# EAGLE design esp32-s2_ePaper_pcb_v1 (EAGLE 9.6.2)
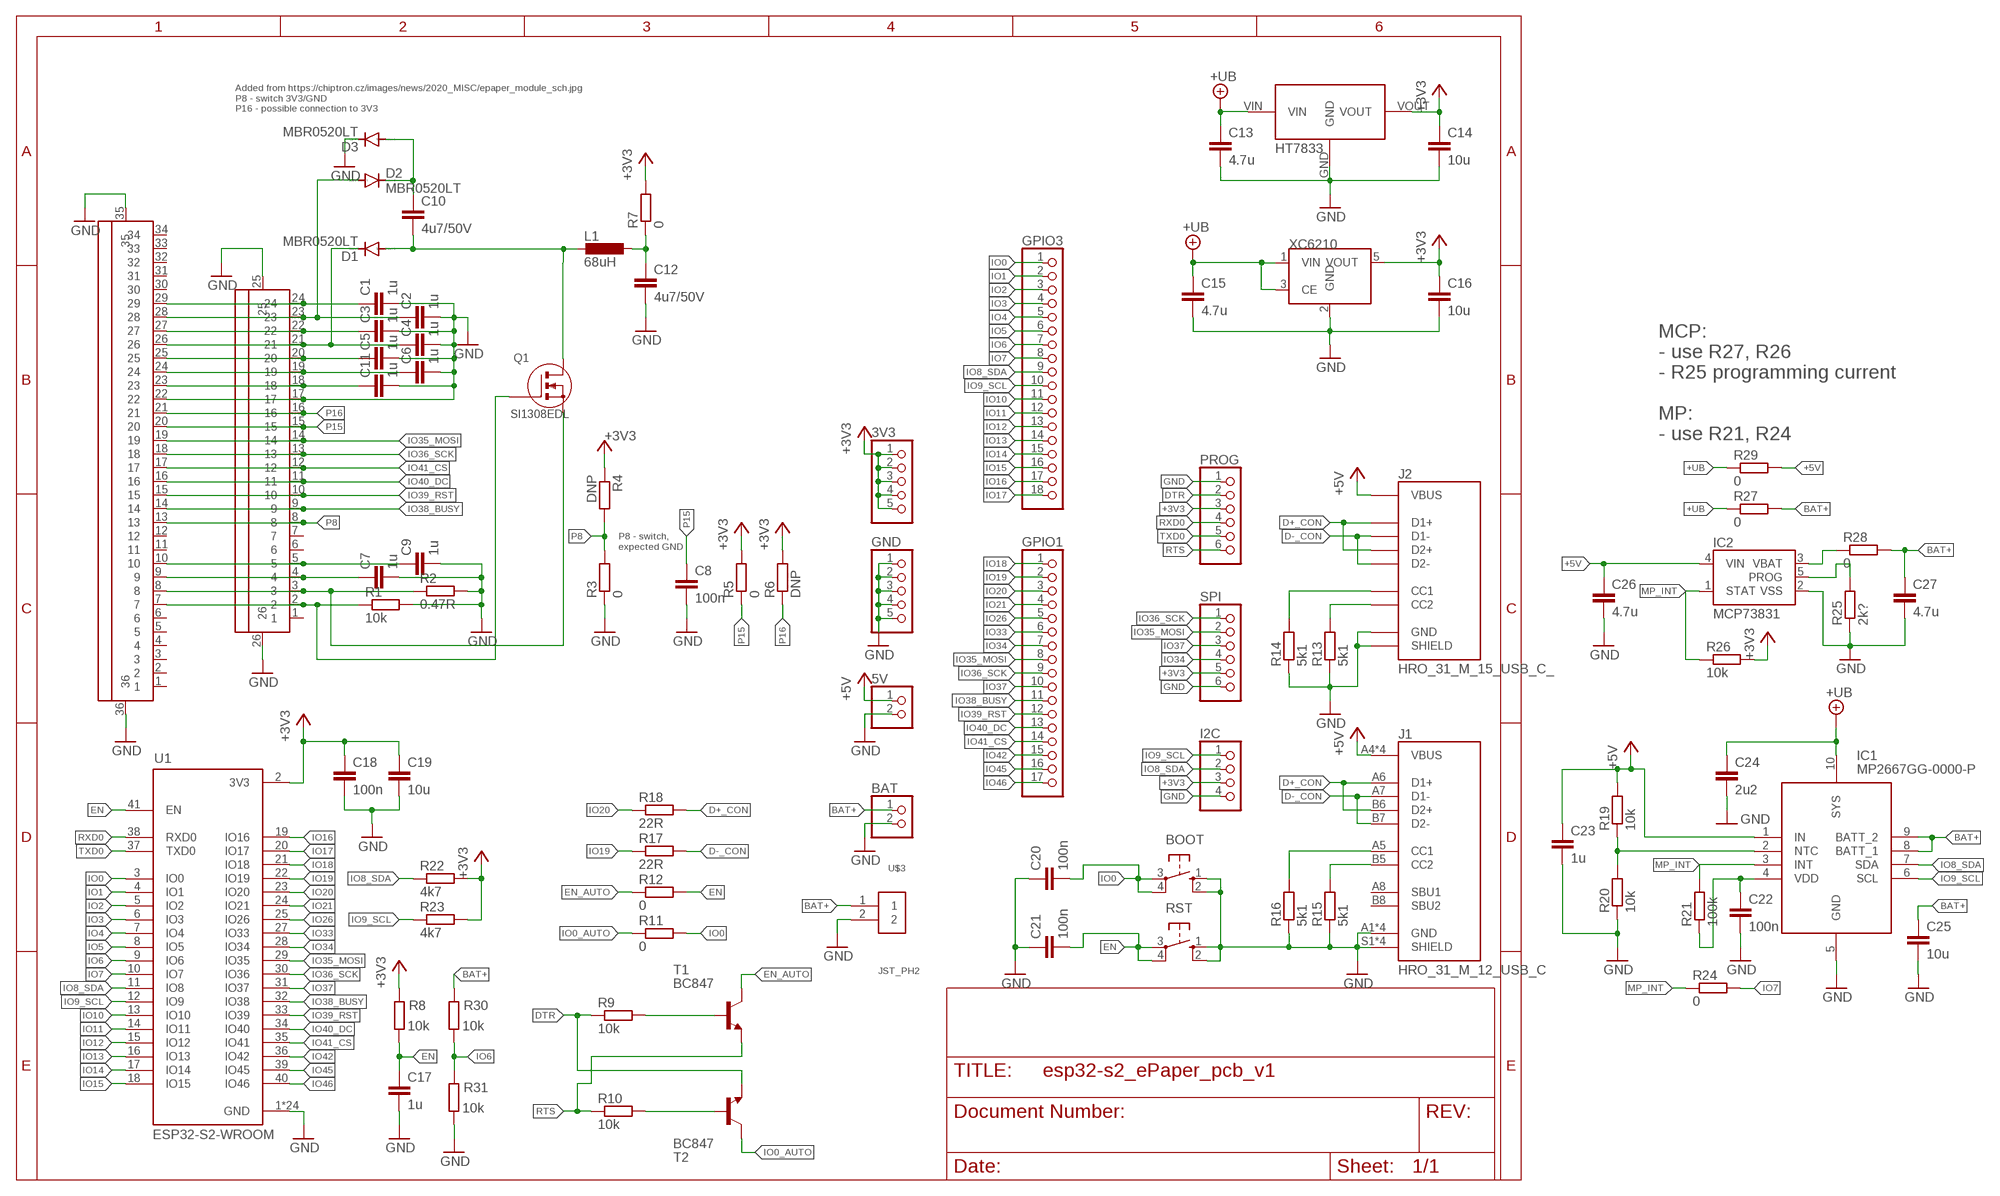
[diagram p0: schematic, sheet 1]

## Parts
3V3  PINHD-1X5  [1X05]
5V  PINHD-1X2  [1X02]
BAT  PINHD-1X2  [1X02]
BOOT  10-XX  [B3F-10XX]
C1  1u  C-EUC0603K  [C0603K]
C2  1u  C-EUC0603K  [C0603K]
C3  1u  C-EUC0603K  [C0603K]
C4  1u  C-EUC0603K  [C0603K]
C5  1u  C-EUC0603K  [C0603K]
C6  1u  C-EUC0603K  [C0603K]
C7  1u  C-EUC0603K  [C0603K]
C8  100n  C-EUC0603K  [C0603K]
C9  1u  C-EUC0603K  [C0603K]
C10  4u7/50V  C-EUC1206  [C1206]
C11  1u  C-EUC0603K  [C0603K]
C12  4u7/50V  C-EUC1206  [C1206]
C13  4.7u  C-EUC1206  [C1206]
C14  10u  C-EUC1206  [C1206]
C15  4.7u  C-EUC1206  [C1206]
C16  10u  C-EUC1206  [C1206]
C17  1u  C-EUC0603K  [C0603K]
C18  100n  C-EUC0603K  [C0603K]
C19  10u  C-EUC1206  [C1206]
C20  100n  C-EUC0603K  [C0603K]
C21  100n  C-EUC0603K  [C0603K]
C22  100n  C-EUC0603K  [C0603K]
C23  1u  C-EUC0603K  [C0603K]
C24  2u2  C-EUC1206  [C1206]
C25  10u  C-EUC1206  [C1206]
C26  4.7u  C-EUC1206  [C1206]
C27  4.7u  C-EUC1206  [C1206]
D1  MBR0520LT  [SOD123]
D2  MBR0520LT  [SOD123]
D3  MBR0520LT  [SOD123]
GND  PINHD-1X5  [1X05]
GPIO1  PINHD-1X17  [1X17]
GPIO3  PINHD-1X18  [1X18]
I2C  PINHD-1X4  [1X04]
IC1  MP2667GG-0000-P  [QFN50P200X200X105-10N]
IC2  MCP73831  [SOT95P290X120-5]
J1  HRO_31_M_12_USB_C  [HRO_31_M_12_USB_C]
J2  HRO_31_M_15_USB_C_  [HRO_31_M_15_USB_C]
L1  68uH  L-EUL4532P  [L4532P]
PROG  PINHD-1X6  [1X06]
Q1  SI1308EDL  [SC-70]
R1  10k  R-EU_R0603  [R0603]
R2  0.47R  R-EU_R0603  [R0603]
R3  0  R-EU_R0603  [R0603]
R4  DNP  R-EU_R0603  [R0603]
R5  0  R-EU_R0603  [R0603]
R6  DNP  R-EU_R0603  [R0603]
R7  0  R-EU_R0603  [R0603]
R8  10k  R-EU_R0603  [R0603]
R9  10k  R-EU_R0603  [R0603]
R10  10k  R-EU_R0603  [R0603]
R11  0  R-EU_R0603  [R0603]
R12  0  R-EU_R0603  [R0603]
R13  5k1  R-EU_R0603  [R0603]
R14  5k1  R-EU_R0603  [R0603]
R15  5k1  R-EU_R0603  [R0603]
R16  5k1  R-EU_R0603  [R0603]
R17  22R  R-EU_R0603  [R0603]
R18  22R  R-EU_R0603  [R0603]
R19  10k  R-EU_R0603  [R0603]
R20  10k  R-EU_R0603  [R0603]
R21  100k  R-EU_R0603  [R0603]
R22  4k7  R-EU_R0603  [R0603]
R23  4k7  R-EU_R0603  [R0603]
R24  0  R-EU_R0603  [R0603]
R25  2k?  R-EU_R0603  [R0603]
R26  10k  R-EU_R0603  [R0603]
R27  0  R-EU_R0603  [R0603]
R28  0  R-EU_R0603  [R0603]
R29  0  R-EU_R0603  [R0603]
R30  10k  R-EU_R0603  [R0603]
R31  10k  R-EU_R0603  [R0603]
RST  10-XX  [B3F-10XX]
SPI  PINHD-1X6  [1X06]
T1  BC847  [SOT23]
T2  BC847  [SOT23]
U1  ESP32-S2-WROOM  [XCVR_ESP32-S2-WROOM]
U2  HT7833  [SOT89]
U3  XC6210  [SOT-23-5]
U$1  AYF532435_FPC_24PIN_0.5  [FPC_0.5_24PIN]
U$2  AYF533435_FPC_34PIN_0.5  [FPC_0.5_34PIN]
U$3  JST_PH2  [JSTPH2]

## Nets
+3V3: 3V3.1 3V3.2 3V3.3 3V3.4 3V3.5 C14.1 C16.1 C18.1 C19.1 I2C.3 PROG.3 R4.1 R5.2 R6.2 R7.2 R8.2 R22.2 R23.2 R26.2 SPI.5 U1.2(3V3) U2.VOUT U3.5(VOUT)
+5V: 5V.1 C23.1 C26.1 IC1.1(IN) IC2.4(VIN) J1.A4(VBUS) J1.A9(VBUS) J1.B4(VBUS) J1.B9(VBUS) J2.P$2(VBUS) J2.P$6(VBUS) J2.P$9(VBUS) J2.P$13(VBUS) R19.2 R29.2
+UB: C13.1 C15.1 C24.1 IC1.10(SYS) R27.1 R29.1 U2.VIN U3.1(VIN) U3.3(CE)
BAT+: BAT.1 C25.1 C27.1 IC1.8(BATT_1) IC1.9(BATT_2) R27.2 R28.2 R30.2 U$3.1
D+_CON: J1.A6(D1+) J1.B6(D2+) J2.P$4(D1+) J2.P$11(D2+) R18.2
D-_CON: J1.A7(D1-) J1.B7(D2-) J2.P$3(D1-) J2.P$10(D2-) R17.2
DTR: PROG.2 R9.1 T2.2(E)
EN: C17.1 C21.2 R8.1 R12.2 RST.3(P) RST.4(P1) U1.41(EN)
EN_AUTO: R12.1 T1.3(C)
GND: 5V.2 BAT.2 BOOT.1(S) BOOT.2(S1) C1.2 C2.2 C3.2 C4.2 C5.2 C6.2 C7.2 C8.2 C9.2 C11.2 C12.2 C13.2 C14.2 C15.2 C16.2 C17.2 C18.2 C19.2 C20.1 C21.1 C22.2 C23.2 C24.2 C25.2 C26.2 C27.2 D3.C GND.1 GND.2 GND.3 GND.4 GND.5 I2C.4 IC1.5(GND) IC2.2(VSS) J1.A1(GND) J1.A12(GND) J1.B1(GND) J1.B12(GND) J1.S1(SHIELD) J1.S2(SHIELD) J1.S3(SHIELD) J1.S4(SHIELD) J2.P$1(GND) J2.P$7(GND) J2.P$8(GND) J2.P$14(GND) J2.P$15(SHIELD) J2.P$16(SHIELD) J2.P$17(SHIELD) J2.P$18(SHIELD) PROG.1 R1.2 R2.2 R3.1 R13.1 R14.1 R15.1 R16.1 R20.1 R25.1 R31.1 RST.1(S) RST.2(S1) SPI.6 U1.1(GND) U1.26(GND) U1.42(GND) U1.43.1(GND) U1.43.2(GND) U1.43.3(GND) U1.43.4(GND) U1.43.5(GND) U1.43.6(GND) U1.43.7(GND) U1.43.8(GND) U1.43.9(GND) U1.43.10(GND) U1.43.11(GND) U1.43.12(GND) U1.43.13(GND) U1.43.14(GND) U1.43.15(GND) U1.43.16(GND) U1.43.17(GND) U1.43.18(GND) U1.43.19(GND) U1.43.20(GND) U1.43.21(GND) U2.GND U3.2(GND) U$1.17 U$1.25 U$1.26 U$2.22 U$2.35 U$2.36 U$3.2
IO0: BOOT.3(P) BOOT.4(P1) C20.2 GPIO3.1 R11.2 U1.3(IO0)
IO0_AUTO: R11.1 T2.3(C)
IO1: GPIO3.2 U1.4(IO1)
IO2: GPIO3.3 U1.5(IO2)
IO3: GPIO3.4 U1.6(IO3)
IO4: GPIO3.5 U1.7(IO4)
IO5: GPIO3.6 U1.8(IO5)
IO6: GPIO3.7 R30.1 R31.2 U1.9(IO6)
IO7: GPIO3.8 R24.2 U1.10(IO7)
IO8_SDA: GPIO3.9 I2C.2 IC1.7(SDA) R22.1 U1.11(IO8)
IO9_SCL: GPIO3.10 I2C.1 IC1.6(SCL) R23.1 U1.12(IO9)
IO10: GPIO3.11 U1.13(IO10)
IO11: GPIO3.12 U1.14(IO11)
IO12: GPIO3.13 U1.15(IO12)
IO13: GPIO3.14 U1.16(IO13)
IO14: GPIO3.15 U1.17(IO14)
IO15: GPIO3.16 U1.18(IO15)
IO16: GPIO3.17 U1.19(IO16)
IO17: GPIO3.18 U1.20(IO17)
IO18: GPIO1.1 U1.21(IO18)
IO19: GPIO1.2 R17.1 U1.22(IO19)
IO20: GPIO1.3 R18.1 U1.23(IO20)
IO21: GPIO1.4 U1.24(IO21)
IO26: GPIO1.5 U1.25(IO26)
IO33: GPIO1.6 U1.27(IO33)
IO34: GPIO1.7 SPI.4 U1.28(IO34)
IO35_MOSI: GPIO1.8 SPI.2 U1.29(IO35) U$1.14 U$2.19
IO36_SCK: GPIO1.9 SPI.1 U1.30(IO36) U$1.13 U$2.18
IO37: GPIO1.10 SPI.3 U1.31(IO37)
IO38_BUSY: GPIO1.11 U1.32(IO38) U$1.9 U$2.14
IO39_RST: GPIO1.12 U1.33(IO39) U$1.10 U$2.15
IO40_DC: GPIO1.13 U1.34(IO40) U$1.11 U$2.16
IO41_CS: GPIO1.14 U1.35(IO41) U$1.12 U$2.17
IO42: GPIO1.15 U1.36(IO42)
IO45: GPIO1.16 U1.39(IO45)
IO46: GPIO1.17 U1.40(IO46)
MP_INT: IC1.3(INT) IC2.1(STAT) R21.2 R24.1 R26.1
N$1: C1.1 U$1.24 U$2.29
N$2: C2.1 D2.A U$1.23 U$2.28
N$3: C3.1 U$1.22 U$2.27
N$4: C4.1 D1.C U$1.21 U$2.26
N$5: C5.1 U$1.20 U$2.25
N$6: C6.1 U$1.19 U$2.24
N$7: C11.1 U$1.18 U$2.23
N$8: C12.1 L1.1 R7.1
N$9: IC2.3(VBAT) R28.1
N$10: Q1.2(S) R2.1 U$1.3 U$2.8
N$11: C9.1 U$1.5 U$2.10
N$12: C7.1 U$1.4 U$2.9
N$13: Q1.1(G) R1.1 U$1.2 U$2.7
N$14: IC1.2(NTC) R19.1 R20.2
N$16: C10.1 D2.C D3.A
N$17: IC2.5(PROG) R25.2
N$18: C22.1 IC1.4(VDD) R21.1
N$19: C10.2 D1.A L1.2 Q1.3(D)
N$21: J2.P$12(CC2) R13.2
N$22: J2.P$5(CC1) R14.2
N$23: J1.B5(CC2) R15.2
N$24: J1.A5(CC1) R16.2
N$28: R10.2 T2.1(B)
N$52: R9.2 T1.1(B)
P8: R3.2 R4.2 U$1.8 U$2.13
P15: C8.1 R5.1 U$1.15 U$2.20
P16: R6.1 U$1.16 U$2.21
RTS: PROG.6 R10.1 T1.2(E)
RXD0: PROG.4 U1.38(RXD0)
TXD0: PROG.5 U1.37(TXD0)
Unconnected: J1.A8(SBU1) J1.B8(SBU2) U$1.1 U$1.6 U$1.7 U$2.1 U$2.2 U$2.3 U$2.4 U$2.5 U$2.6 U$2.11 U$2.12 U$2.30 U$2.31 U$2.32 U$2.33 U$2.34

## Notes on the sheet
- Added from https://chiptron.cz/images/news/2020_MISC/epaper_module_sch.jpg
  P8 - switch 3V3/GND
  P16 - possible connection to 3V3
- MCP:
  - use R27, R26
  - R25 programming current
  
  MP:
  - use R21, R24
- P8 - switch,
  expected GND

## Library data of the parts
3V3 GND = pinhead:PINHD-1X5: PIN HEADER
5V BAT = pinhead:PINHD-1X2: PIN HEADER
BOOT RST = switch-omron:10-XX: OMRON SWITCH; MPN: B3F-1000; OC_FARNELL: 176432; OC_NEWARK: 36M3542
C1-C27 = rcl:C-EU: CAPACITOR, European symbol; SPICEPREFIX: C
D1-D3 = diode:MBR0520LT: SCHOTTKY BARRIER RECTIFIER Source: http://onsemi.com .. MBR0520LT1-D.pdf
GPIO1 = pinhead:PINHD-1X17: PIN HEADER
GPIO3 = pinhead:PINHD-1X18: PIN HEADER
I2C = pinhead:PINHD-1X4: PIN HEADER
IC1 = Bastlir:MP2667GG-0000-P: BATT CHARGER, 4.2V, -40 TO 125DEG C; Battery Type:Li-Ion, Li-Pol; Input Voltage:5V; Battery Charge Voltage:4.2V; Charge Current Max:1A; Battery IC Case Style:QFN; No. of Pins:10Pins; No. of Series Cells:1; Product Range:- RoHS Compliant: Yes Source: Datasheet; DESCRIPTION: BATT CHARGER, 4.2V, -40 TO 125DEG C; Battery Type:Li-Ion, Li-Pol; Input Voltage:5V; Battery Charge Voltage:4.2V; Charge Current Max:1A; Battery IC Case Style:QFN; No. of Pins:10Pins; No. of Series Cells:1; Product Range:- RoHS Compliant: Yes; HEIGHT: 1.05mm; MANUFACTURER_NAME: Monolithic Power Systems (MPS); MANUFACTURER_PART_NUMBER: MP2667GG-0000-P; MOUSER_PART_NUMBER: 946-MP2667GG-0000-P; MOUSER_PRICE-STOCK: https://www.mouser.co.uk/ProductDetail/Monolithic-Power-Systems-MPS/MP2667GG-0000-P?qs=%2F4dsY8i%2FUxK26ddm8WbL%252Bg%3D%3D
IC2 = Bastlir:MCP73831
J1 = Bastlir:HRO_31_M_12_USB_C: USB Shielded I/O Receptacle; Type C; Right Angle; Surface Mount; Gold over Nickel
J2 = Bastlir:HRO_31_M_15_USB_C: datasheet <https://datasheet.lcsc.com/szlcsc/1811101526_Korean-Hroparts-Elec-TYPE-C-31-M-15_C223908.pdf>
L1 = rcl:L-EU: INDUCTOR, European symbol; SPICEPREFIX: L
PROG SPI = pinhead:PINHD-1X6: PIN HEADER
Q1 = tr-j:SI1308EDL
R1-R31 = rcl:R-EU_: RESISTOR, European symbol; SPICEPREFIX: R
T1 T2 = transistor:BC847: NPN TRANSISTOR
U1 = Bastlir:ESP32-S2-WROOM: WiFi 802.11b/g/n Transceiver Module 2.4GHz PCB Trace Surface Mount Check prices <https://pricing.snapeda.com/search/part/ESP32-S2-WROOM/?ref=eda>; AVAILABILITY: Bad; DESCRIPTION: WiFi 802.11b/g/n Transceiver Module 2.4GHz PCB Trace Surface Mount; MF: Espressif Systems; MP: ESP32-S2-WROOM; PACKAGE: VFQFN-56 Espressif Systems; PRICE: None
U2 = Bastlir:HT7833
U3 = Bastlir:XC6210
U$1 = ESP32-S2-WROOM:AYF532435_FPC_24PIN_0.5
U$2 = Bastlir:AYF533435_FPC_34PIN_0.5
U$3 = Bastlir:JST_PH2

## Board
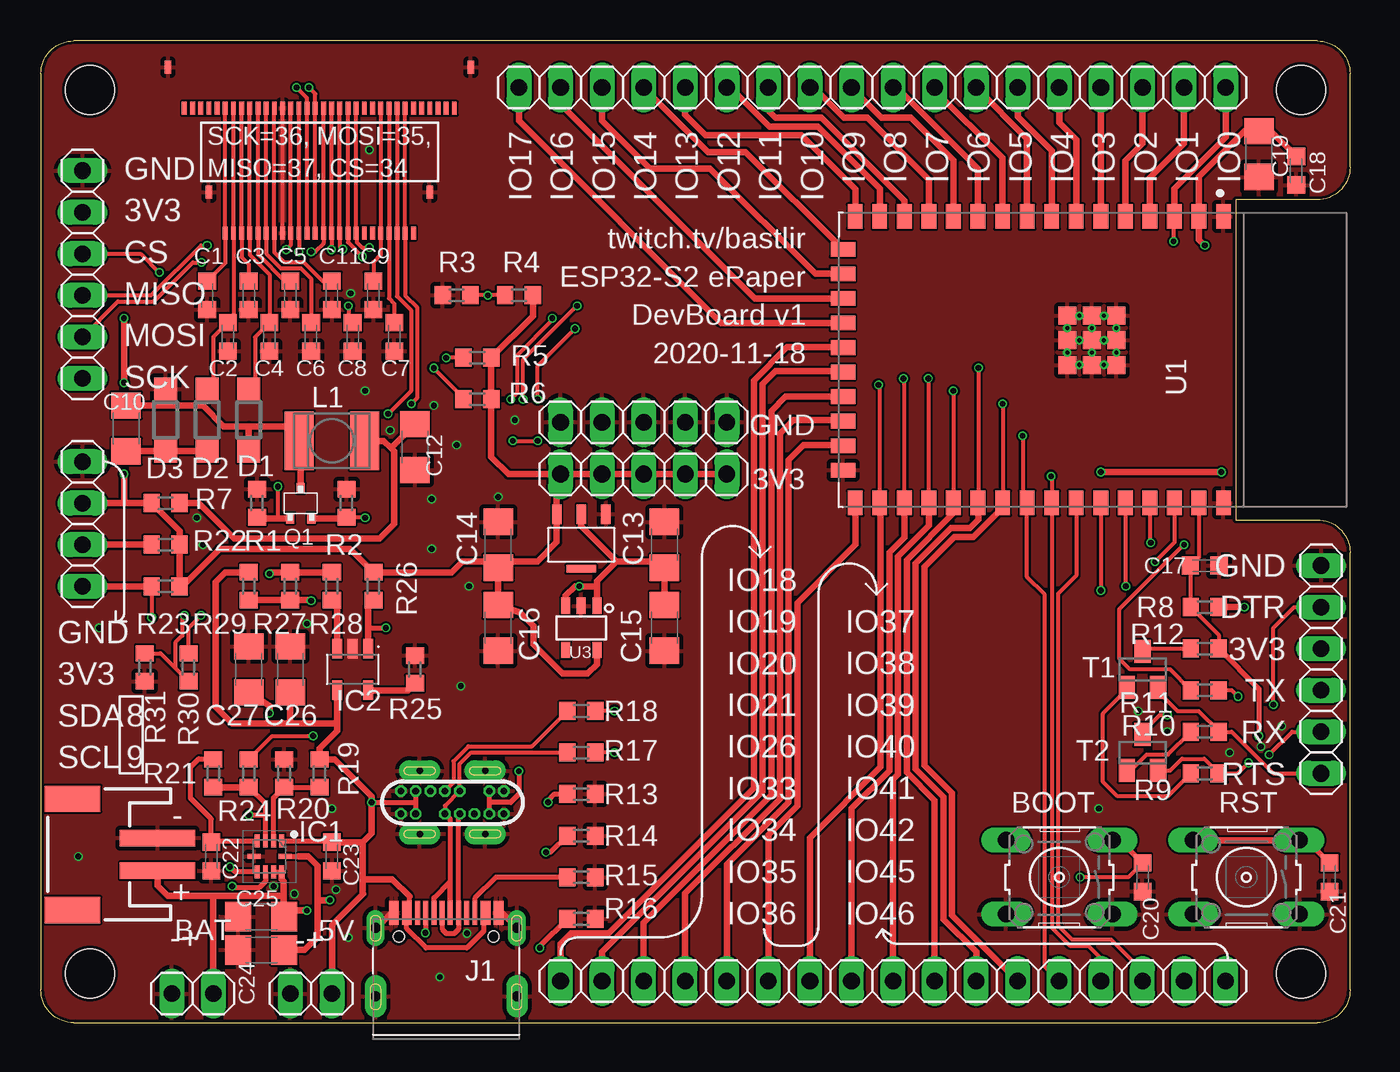
[diagram p1: board, top side]
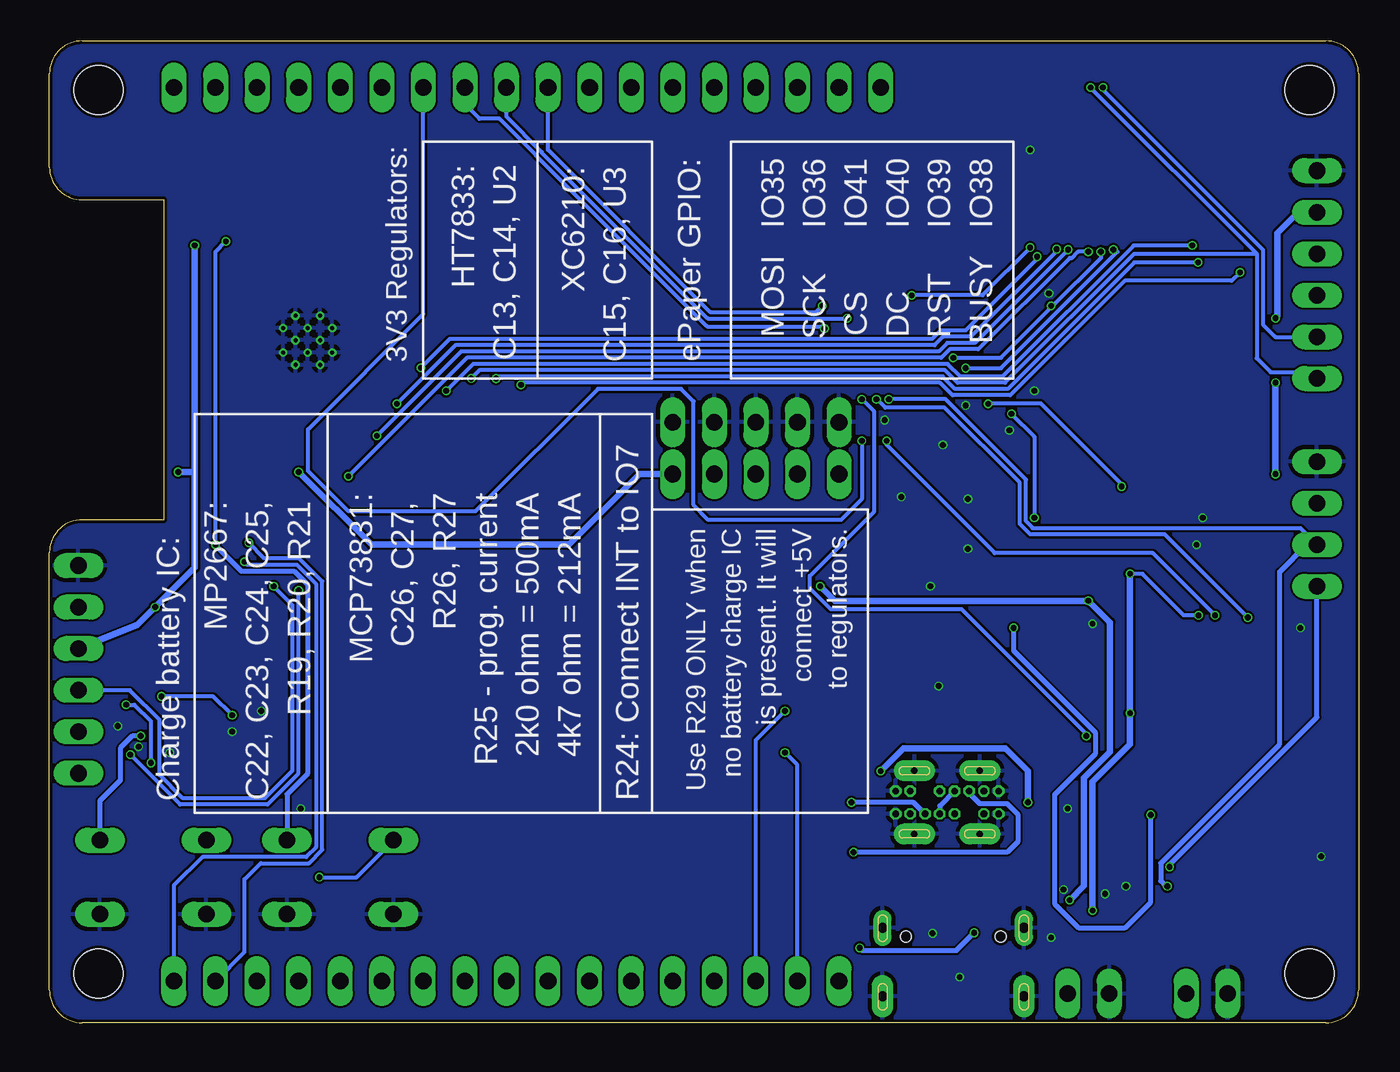
[diagram p2: board, bottom side, seen from below]

Size 80 x 60 mm. Coordinates in mm from the lower left corner, seen from the top.
Outline: 2,0 78,0 arc90 80,2 80,28.73 arc90 78,30.73 73.03,30.73 73.03,50.29 78,50.29 arc90 80,52.29 80,58 arc90 78,60 2,60 arc90 0,58 0,2 arc90 2,0
Copper layers (1*16): Top 0.035559375mm / dielectric 1.6mm / Bottom 0.035559375mm
Design rules "jlcpcb2layer": minimum track width 5mil, minimum drill 12mil, track to track 5mil, track to pad 5mil, pad to pad 5mil, via to via 5mil, smd to smd 5mil, copper to edge 8mil, drill to drill 6mil, minimum pad ring 5mil, minimum via ring 3mil, stop-mask expansion 2.5mil, vias tented up to drill 0mil, thermal gap 10mil
Holes 3 mm at 77,57 3,57 3,3 77,3

### Footprints (pad centres in the part's own frame; a part is rotated, then mirrored left to right if it is on the bottom)
1X05 = drill 1.016 long: 1 -5.08,0; 2 -2.54,0; 3 0,0; 4 2.54,0; 5 5.08,0
1X02 = drill 1.016 long: 1 -1.27,0; 2 1.27,0
B3F-10XX = drill 1.016 long: 1 -3.251,2.261; 2 3.251,2.261; 3 -3.251,-2.261; 4 3.251,-2.261
C0603K = smd 1.05 x 1.08: 1 -0.875,0; 2 0.875,0
C1206 = smd 1.6 x 1.8: 1 -1.4,0; 2 1.4,0
SOD123 = smd 1.4 x 1.4: A 1.9,0; C -1.9,0
1X17 = drill 1.016 long: 1 -20.32,0; 2 -17.78,0; 3 -15.24,0; 4 -12.7,0; 5 -10.16,0; 6 -7.62,0; 7 -5.08,0; 8 -2.54,0; 9 0,0; 10 2.54,0; 11 5.08,0; 12 7.62,0; 13 10.16,0; 14 12.7,0; 15 15.24,0; 16 17.78,0; 17 20.32,0
1X18 = drill 1.016 long: 1 -21.59,0; 2 -19.05,0; 3 -16.51,0; 4 -13.97,0; 5 -11.43,0; 6 -8.89,0; 7 -6.35,0; 8 -3.81,0; 9 -1.27,0; 10 1.27,0; 11 3.81,0; 12 6.35,0; 13 8.89,0; 14 11.43,0; 15 13.97,0; 16 16.51,0; 17 19.05,0; 18 21.59,0
1X04 = drill 1.016 long: 1 -3.81,0; 2 -1.27,0; 3 1.27,0; 4 3.81,0
QFN50P200X200X105-10N = smd 0.8 x 0.3: 1 -0.95,0.75; 2 -0.95,0.25; 3 -0.95,-0.25; 4 -0.95,-0.75; 6 0.95,-0.75; 7 0.95,-0.25; 8 0.95,0.25; 9 0.95,0.75 | smd 0.3 x 0.8: 5 0,-0.95; 10 0,0.95
SOT95P290X120-5 = smd 1.18 x 0.609: 1 -1.274,0.95; 2 -1.274,0; 3 -1.274,-0.95; 4 1.274,-0.95; 5 1.274,0.95
HRO_31_M_12_USB_C = smd 0.3 x 1.45: A1 -3.35,4.045; A4 -2.55,4.045; A5 -1.25,4.045; A6 -0.25,4.045; A7 0.25,4.045; A8 1.25,4.045; A9 2.55,4.045; A12 3.35,4.045; B1 3.05,4.045; B4 2.25,4.045; B5 1.75,4.045; B6 0.75,4.045; B7 -0.75,4.045; B8 -1.75,4.045; B9 -2.25,4.045; B12 -3.05,4.045 | drill 0.6 pad 1.1 long: S1 -4.32,3.13; S2 4.32,3.13 | drill 0.6 pad 1.3 long: S3 -4.32,-1.05; S4 4.32,-1.05 | hole 0.65: -2.89,2.6; 2.89,2.6
HRO_31_M_15_USB_C = drill 0.4 pad 0.7 octagon: P$1 3.15,0.7; P$2 2.25,0.7; P$3 0.45,0.7; P$4 -0.45,0.7; P$5 -1.35,0.7; P$6 -2.25,0.7; P$7 -3.15,0.7; P$8 -3.15,-0.7; P$9 -2.25,-0.7; P$10 -0.45,-0.7; P$11 0.45,-0.7; P$12 1.35,-0.7; P$13 2.25,-0.7; P$14 3.15,-0.7 | drill 0.4 pad 1.27 long: P$15 2,1.93; P$16 -2,1.93; P$17 2,-1.93; P$18 -2,-1.93
L4532P = smd 1.8 x 3.6: 1 -2,0; 2 2,0
1X06 = drill 1.016 long: 1 -6.35,0; 2 -3.81,0; 3 -1.27,0; 4 1.27,0; 5 3.81,0; 6 6.35,0
SC-70 = smd 0.5 x 0.6: 1 -0.65,-0.93; 2 0.65,-0.93; 3 0,0.93
R0603 = smd 1 x 1.1: 1 -0.85,0; 2 0.85,0
SOT23 = smd 1 x 1.4: 1 -0.95,-1.1; 2 0.95,-1.1; 3 0,1.1
XCVR_ESP32-S2-WROOM = smd 1.5 x 0.9: 1 -8.75,8; 2 -8.75,6.5; 3 -8.75,5; 4 -8.75,3.5; 5 -8.75,2; 6 -8.75,0.5; 7 -8.75,-1; 8 -8.75,-2.5; 9 -8.75,-4; 10 -8.75,-5.5; 11 -8.75,-7; 12 -8.75,-8.5; 13 -8.75,-10; 14 -8.75,-11.5; 15 -8.75,-13; 16 -8.75,-14.5; 27 8.75,-14.5; 28 8.75,-13; 29 8.75,-11.5; 30 8.75,-10; 31 8.75,-8.5; 32 8.75,-7; 33 8.75,-5.5; 34 8.75,-4; 35 8.75,-2.5; 36 8.75,-1; 37 8.75,0.5; 38 8.75,2; 39 8.75,3.5; 40 8.75,5; 41 8.75,6.5; 42 8.75,8 | smd 0.9 x 1.5: 17 -6.75,-15.25; 18 -5.25,-15.25; 19 -3.75,-15.25; 20 -2.25,-15.25; 21 -0.75,-15.25; 22 0.75,-15.25; 23 2.25,-15.25; 24 3.75,-15.25; 25 5.25,-15.25; 26 6.75,-15.25 | smd 1.1 x 1.1: 43.1 -1.19,-0.05; 43.2 -2.69,-0.05; 43.3 0.31,-0.05; 43.4 -2.69,-1.55; 43.5 -1.19,-1.55; 43.6 0.31,-1.55; 43.7 -2.69,1.45; 43.8 -1.19,1.45; 43.9 0.31,1.45 | drill 0.25 pad 0.4: 43.10 -1.19,0.7; 43.11 -2.69,0.7; 43.12 0.31,0.7; 43.13 -2.69,-0.8; 43.14 -1.19,-0.8; 43.15 0.31,-0.8; 43.16 -1.94,1.45; 43.17 -0.44,1.45; 43.18 -1.94,-0.05; 43.19 -0.44,-0.05; 43.20 -1.94,-1.55; 43.21 -0.44,-1.55
SOT89 = smd 0.559 x 1.194: GND -1.499,-0.597; VIN 0,-0.597; VOUT 1.499,-0.597 | smd 1.829 x 0.457: P$4 0,2.743
SOT-23-5 = smd 1 x 0.55: 1 -1.35,0.95; 2 -1.35,0; 3 -1.35,-0.95; 4 1.35,-0.95; 5 1.35,0.95
FPC_0.5_24PIN = smd 0.3 x 0.8: 1 -6.215,0; 2 -5.715,0; 3 -5.215,0; 4 -4.715,0; 5 -4.215,0; 6 -3.715,0; 7 -3.215,0; 8 -2.715,0; 9 -2.215,0; 10 -1.715,0; 11 -1.215,0; 12 -0.715,0; 13 -0.215,0; 14 0.285,0; 15 0.785,0; 16 1.285,0; 17 1.785,0; 18 2.285,0; 19 2.785,0; 20 3.285,0; 21 3.785,0; 22 4.285,0; 23 4.785,0; 24 5.285,0 | smd 0.4 x 0.8: 25 -7.215,-2.5; 26 6.285,-2.5
FPC_0.5_34PIN = smd 0.3 x 0.8: 1 -8.755,0; 2 -8.255,0; 3 -7.755,0; 4 -7.255,0; 5 -6.755,0; 6 -6.255,0; 7 -5.755,0; 8 -5.255,0; 9 -4.755,0; 10 -4.255,0; 11 -3.755,0; 12 -3.255,0; 13 -2.755,0; 14 -2.255,0; 15 -1.755,0; 16 -1.255,0; 17 -0.755,0; 18 -0.255,0; 19 0.245,0; 20 0.745,0; 21 1.245,0; 22 1.745,0; 23 2.245,0; 24 2.745,0; 25 3.245,0; 26 3.745,0; 27 4.245,0; 28 4.745,0; 29 5.245,0; 30 5.745,0; 31 6.245,0; 32 6.745,0; 33 7.245,0; 34 7.745,0 | smd 0.4 x 0.8: 35 -9.755,-2.5; 36 8.745,-2.5
JSTPH2 = smd 1 x 4.6: 1 -1,-3.7; 2 1,-3.7 | smd 1.6 x 3.4: NC1 -3.4,1.5; NC2 3.4,1.5

### Placement (x,y rotation side)
3V3  36.83,33.53 180 top
5V  16.51,1.78 180 top
BAT  9.27,1.78 180 top
BOOT  62.23,8.89 180 top
C1  10.16,44.45 270 top
C2  11.43,41.91 270 top
C3  12.7,44.45 270 top
C4  13.97,41.91 270 top
C5  15.24,44.45 270 top
C6  16.51,41.91 270 top
C7  21.59,41.91 270 top
C8  19.05,41.91 270 top
C9  20.32,44.45 270 top
C10  5.21,36.32 90 top
C11  17.78,44.45 270 top
C12  22.86,35.18 270 top
C13  38.1,29.21 90 top
C14  27.94,29.21 90 top
C15  38.1,24.13 270 top
C16  27.94,24.13 270 top
C17  71.12,27.94 0 top
C18  76.71,52.07 270 top
C19  74.42,53.09 270 top
C20  67.31,8.89 90 top
C21  78.74,8.89 90 top
C22  10.41,10.16 270 top
C23  17.78,10.16 270 top
C24  13.46,4.45 180 top
C25  13.46,6.48 180 top
C26  15.24,21.59 90 top
C27  12.7,21.59 90 top
D1  12.7,36.83 270 top
D2  10.16,36.83 90 top
D3  7.62,36.83 270 top
GND  36.83,36.7 180 top
GPIO1  52.07,2.54 0 top
GPIO3  50.8,57.15 180 top
I2C  2.54,30.48 90 top
IC1  13.97,10.16 270 top
IC2  19.05,21.59 270 top
J1  24.77,2.67 0 top
J2  25.15,13.46 0 top
L1  17.78,35.56 180 top
PROG  78.23,21.59 270 top
Q1  15.88,31.75 0 top
R1  13.21,31.75 90 top
R2  18.67,31.75 90 top
R3  25.4,44.45 0 top
R4  29.21,44.45 180 top
R5  26.67,40.64 0 top
R6  26.67,38.1 0 top
R7  7.62,31.75 180 top
R8  71.12,25.4 0 top
R9  71.12,15.24 180 top
R10  71.12,17.78 180 top
R11  71.12,20.32 180 top
R12  71.12,22.86 0 top
R13  33.02,13.97 180 top
R14  33.02,11.43 180 top
R15  33.02,8.89 180 top
R16  33.02,6.35 180 top
R17  33.02,16.51 180 top
R18  33.02,19.05 180 top
R19  17.02,15.24 90 top
R20  14.86,15.24 270 top
R21  10.54,15.24 270 top
R22  7.62,29.21 0 top
R23  7.62,26.67 0 top
R24  12.7,15.24 90 top
R25  22.86,21.59 270 top
R26  20.32,26.67 90 top
R27  15.24,26.67 90 top
R28  17.78,26.67 90 top
R29  12.7,26.67 90 top
R30  9.02,21.72 90 top
R31  6.35,21.72 90 top
RST  73.66,8.89 180 top
SPI  2.54,45.72 90 top
T1  67.31,21.59 0 top
T2  67.31,16.51 0 top
U1  64.26,40.51 270 top
U2  33.02,30.48 180 top
U3  33.02,24.13 270 top
U$1  16.55,48.26 180 top
U$2  16.51,55.88 180 top
U$3  3.43,10.29 90 top

### Tracks (layer width: path | path; a pad name or v marks a point on that pad's centre or on a via)
+3V3  (via drill 0.35)
  Top 0.305: 28.01,28.19 C14.1
  Top 0.406: R4.1 30.06,43.18 R5.2 R6.2 27.52,34.58 28.57,33.53 3V3.5 | I2C.3 5.08,31.75 | 5.08,31.75 R7.2 8.47,30.05 R22.2 R23.2 8.64,26.67 10.92,28.96 18.88,28.96 R26.2 25.11,27.52 25.78,28.19 28.01,28.19 30.35,28.19 31.52,29.36 U2.VOUT 31.52,33.3 3V3.5 | C14.1 C16.1 29.28,25.08 30.1,24.26 30.1,23.11 31.88,21.34 33.4,21.34 33.97,21.91 U3.5 | C18.1 75.17,54.49 C19.1 73.54,54.49 70.76,51.71 U1.2 70.76,47.86 v71.12,47.5 | R8.2 v73.53,25.4 | 3V3.5 3V3.4 3V3.3 3V3.2 3V3.1 | v64.77,33.66 v72.14,33.66 | 5.08,31.75 v5.08,33.53 | v5.08,39.12 v5.08,43.05
  Bottom 0.406: PROG.3 74.63,24.3 v73.53,25.4 71.12,27.81 71.12,33.66 | v71.12,47.5 71.12,33.66 | 3V3.1 43.94,33.53 48.26,29.21 60.33,29.21 v64.77,33.66 | v72.14,33.66 71.12,33.66 | v5.08,33.53 v5.08,39.12 | v5.08,43.05 4.95,43.18 4.95,48.26 3.68,49.53 SPI.5
+5V  (via drill 0.35)
  Top 0.305: J1.B4 J1.A9 27.05,6.45 27.05,5.59 26.04,4.57 23.53,4.57 22.35,5.75 22.35,6.55 J1.B9 | J2.P$2 27.4,13.46 | 27.4,13.46 J2.P$13 | J2.P$6 22.9,13.46 | 22.9,13.46 J2.P$9 | v20.21,13.46 22.9,13.46 | IC1.1 17.7,11.11 C23.1 | v29.21,15.37 29.21,13.97 28.7,13.46 27.4,13.46 | J1.B9 J1.A4 | J1.B9 22.52,7.71
  Top 0.406: IC2.4 18.1,18.29 | 18.1,18.29 18.1,17.85 17.02,16.76 R19.2 17.95,16.09 20.19,13.84 20.19,13.48 v20.21,13.46 20.21,11.57 19.67,11.04 | R29.2 11.26,27.52 10.67,26.92 10.67,19.3 11.68,18.29 15.24,18.29 | C26.1 15.24,18.29 | 18.1,18.29 15.24,18.29 | C23.1 19.67,11.04 | 5V.1 17.78,5.97 19.68,7.87 19.67,7.89 19.67,8.76 | 19.67,11.04 19.67,8.76 | 22.52,7.71 21.46,8.76 19.67,8.76
  Bottom 0.406: v29.21,15.37 27.81,16.76 21.59,16.76 20.21,15.38 v20.21,13.46
+UB  (via drill 0.35)
  Top 0.305: 38.03,28.19 C13.1 | IC1.10 15.75,10.16
  Top 0.406: R29.1 R27.1 16.47,25.82 v16.51,25.78 | U2.VIN 33.02,30.35 35.18,28.19 | 35.18,28.19 38.03,28.19 | C13.1 C15.1 | U3.1 33.97,26.67 | 33.97,26.67 33.97,26.98 35.18,28.19 | 33.97,26.67 v32.89,26.67 32.64,26.67 32.07,26.1 U3.3 | 16.91,7.49 16.91,5.23 16.13,4.45 C24.1 | 16.91,7.49 16.91,9.58 16.33,10.16 15.75,10.16 | v17.65,7.49 16.91,7.49
  Bottom 0.406: v32.89,26.67 32,25.78 v16.51,25.78 15.2,24.47 15.2,16.55 16.79,14.95 16.79,8.36 v17.65,7.49
BAT+  (via drill 0.35)
  Top 0.254: R30.2 9.02,24.13 v9.78,24.89
  Top 0.305: IC1.8 IC1.9
  Top 0.406: U$3.1 7.13,8.37 7.75,7.75 10.54,7.75 | 10.54,7.75 14.85,7.75 | R28.2 R27.2 14.06,27.52 v13.97,27.43 | C27.1 13.97,19.37 v13.97,18.92 | v16.26,6.86 15.49,6.86 14.73,6.1 14.46,6.1 C25.1 14.85,6.49 14.85,7.75 | BAT.1 10.54,7.75 | IC1.9 14.72,8.78 14.85,8.65 14.85,7.75
  Bottom 0.254: v9.78,24.89 10.67,24.89 13.21,27.43 v13.97,27.43
  Bottom 0.406: v16.26,6.86 16.26,14.73 13.97,17.02 v13.97,18.92 v13.97,27.43
D+_CON
  Top 0.254: R18.2 30.01,16.89 26.13,16.89 25.57,16.34 25.21,15.97 25.21,14.68 J2.P$4
  Top 0.305: J1.A6 24.52,5.71 24.77,5.46 25.27,5.46 25.52,5.7 J1.B6 25.52,12.68 J2.P$11
  Bottom 0.305: J2.P$4 25.6,13.26 J2.P$11
D-_CON
  Top 0.254: J2.P$10 24.7,13.26 J2.P$3 25.6,15.82 26.29,16.51 R17.2
  Top 0.305: J1.B7 24.02,7.63 25.02,8.63 J1.A7 25.02,12.44 J2.P$10
DTR  (via drill 0.35)
  Top 0.254: T2.2 69,15.41 69.72,16.13 71.08,16.13 R9.1 73.15,15.24 v73.79,15.88 | v75.31,19.43 75.31,24.13 76.58,25.4 PROG.2
  Bottom 0.254: v75.31,19.43 74.8,19.43 73.79,18.41 v73.79,15.88
EN  (via drill 0.35)
  Top 0.254: U1.41 70.76,28.46 C17.1 70.25,25.43 R8.1 71.97,23.7 R12.2
  Top 0.305: R12.2 74.42,20.41 v74.42,17.53 | C21.2 77.35,11.15 RST.3
  Top 0.406: RST.4 RST.3
  Bottom 0.305: v74.42,17.53 74.93,17.53 75.67,16.79 75.67,14.81 76.91,13.56 RST.3
EN_AUTO
  Top 0.254: T1.3 67.48,22.86 R12.1
GND  (via drill 0.35)
  Top 0.254: U$1.17 U$2.22
  Top 0.406: J1.A1 20.5,5.8 J1.S1 | J1.A12 28.17,6.71 J1.S2
  other vias: 20.07,53.34 25.4,35.31 28.96,36.83 16.26,24.38 3.56,24.13 2.29,10.16 18.03,8.13 18.8,5.21 17.78,13.08 67.06,19.05 68.83,17.78 72.64,16.51 9.91,29.21 9.53,30.86 15.49,7.87 26.04,5.46 14.22,8.34 24,37.72 64.64,13.08 74.55,16.86 27.94,32.13 26.16,26.67 23.88,28.96 23.88,32 25.65,20.57 24.38,2.79 21.34,36.2 19.81,38.61 18.92,44.58 75.82,18.13
  pour Top: -1.27,-2.54 82.55,-2.54 82.55,60.96 -1.27,60.96
  pour Bottom: -1.27,-3.81 83.82,-3.81 83.82,62.23 -2.54,62.23 -2.54,-3.81
IO0  (via drill 0.35)
  Top 0.254: R11.2 69,21.59 66.55,21.59 65.91,22.23 65.91,25.27 v69.85,29.21 | v69.22,47.75 69.22,49.22 U1.3 | C20.2 66.44,8.89 v63.5,8.89
  Top 0.305: BOOT.3 65.92,11.15 C20.2
  Top 0.406: U1.3 69.26,50.97 72.39,54.1 GPIO3.1
  Bottom 0.254: v69.85,29.21 69.85,47.12 v69.22,47.75 | v63.5,8.89 61.24,8.89 BOOT.4
  Bottom 0.305: v69.85,29.21 69.85,29.17 68.27,27.59 65.05,27.59 64.23,26.77 64.23,15.21 65.48,13.95 BOOT.3
IO0_AUTO  (via drill 0.35)
  Top 0.254: T2.3 67.31,17.74 68.37,18.8 v68.83,18.8 | v73.15,19.94 72.77,20.32 R11.1
  Bottom 0.254: v68.83,18.8 69.98,19.94 v73.15,19.94
IO1
  Top 0.406: U1.4 67.76,51.63 69.85,53.72 GPIO3.2
IO2
  Top 0.406: U1.5 66.26,52.67 67.31,53.72 GPIO3.3
IO3
  Top 0.406: U1.6 GPIO3.4
IO4
  Top 0.406: U1.7 63.26,53.96 62.23,54.99 GPIO3.5
IO5
  Top 0.406: U1.8 61.76,53.3 59.69,55.37 GPIO3.6
IO6  (via drill 0.35)
  Top 0.254: R31.2 7.32,22.57 8.21,21.67 | 8.21,21.67 R30.1 | v28.83,35.56 v30.35,35.56 | v8.76,24.89 8.64,24.77 8.64,23.65 8.21,23.23 8.21,21.68 8.21,21.67
  Top 0.406: U1.9 60.26,54.04 GPIO3.7
  Bottom 0.254: v8.76,24.89 12.57,28.7 22.23,28.7 28.83,35.31 v28.83,35.56 | v30.35,35.56 30.35,32 31.62,30.73 39.75,30.73 40.64,31.62 40.64,37.97 41.4,38.73 46.48,38.73 53.98,31.24 61.71,31.24 64.19,33.72 64.19,36.26 57.15,43.31 GPIO3.7
IO7  (via drill 0.35)
  Top 0.254: R24.2 14.14,17.53 v16.64,17.53 | v30.35,38.1 30.35,40.13 v32.64,42.42
  Top 0.406: U1.10 58.76,52.85 54.61,57 GPIO3.8
  Bottom 0.254: v16.64,17.53 16.64,17.65 24.26,25.27 32.26,25.27 33.53,26.54 33.53,27.3 29.59,31.24 29.59,37.34 v30.35,38.1 | v32.64,42.42 32.77,42.55 39.81,42.55 50.29,53.02 50.29,53.05 52.48,55.24 53.72,55.24 54.61,56.13 GPIO3.8
IO8_SDA  (via drill 0.35)
  Top 0.254: v28.7,38.1 29.08,38.48 29.08,40.77 31.24,42.93 v31.24,43.05
  Top 0.305: IC1.7 13.72,8.64 13.34,8.26 11.77,8.26 v11.68,8.34
  Top 0.406: I2C.2 R22.1 | U1.11 57.26,52.19 52.3,57.15 GPIO3.9
  Bottom 0.254: I2C.2 3.56,30.23 19.91,30.23 20.33,30.65 20.33,33.19 25.24,38.1 v28.7,38.1 | v31.24,43.05 v31.25,43.04 39.77,43.04 49.91,53.18 49.91,53.21 52.07,55.37 GPIO3.9
  Bottom 0.305: v11.68,8.34 11.77,8.34 12.1,8.67 12.1,9.75 4.83,17.02 4.83,27.56 3.17,29.21 I2C.2
IO9_SCL  (via drill 0.35)
  Top 0.254: R23.1 v6.77,24.77 | v29.46,38.1 29.46,40.51 v32.77,43.81
  Top 0.305: IC1.6 11.87,9.21 v11.56,9.53
  Top 0.406: I2C.1 R23.1 | U1.12 55.76,52.7 53.16,55.3 51.36,55.3 49.53,57.13 GPIO3.10
  Bottom 0.254: v6.77,24.77 11.85,29.84 20.07,29.84 20.71,30.49 20.71,33 25.3,37.58 28.92,37.58 29.43,38.1 v29.46,38.1 | v32.77,43.81 33.15,43.43 39.62,43.43 49.53,53.34 GPIO3.10
  Bottom 0.305: v11.56,9.53 11.56,9.65 2.54,18.67 I2C.1
IO10
  Top 0.406: U1.13 54.26,51.53 50.49,55.3 49.08,55.3 47.22,57.15 GPIO3.11
IO11
  Top 0.406: U1.14 52.76,50.23 47.7,55.3 44.89,55.3 44.45,55.73 GPIO3.12
IO12
  Top 0.406: U1.15 51.26,50.97 47.47,54.76 44.53,54.76 42.14,57.15 GPIO3.13
IO13
  Top 0.406: U1.16 49.76,50.95 46.48,54.23 40.62,54.23 39.37,55.48 GPIO3.14
IO14
  Top 0.406: U1.17 43.06,53.21 40.77,53.21 GPIO3.15
IO15
  Top 0.406: U1.18 47.33,45.76 40.89,52.2 37.21,52.2 34.29,55.12 GPIO3.16
IO16
  Top 0.406: GPIO3.17 31.75,56.14 43.63,44.26 U1.19
IO17
  Top 0.406: U1.20 41.56,42.76 29.21,55.12 GPIO3.18
IO18
  Top 0.406: GPIO1.1 31.75,4.83 32.39,5.47 34.68,5.47 43.56,14.35 43.56,39.24 45.59,41.27 49,41.27 U1.21
IO19  (via drill 0.35)
  Top 0.254: v35.05,16.51 R17.1
  Top 0.406: GPIO1.2 34.29,4.33 44.09,14.13 44.09,39.02 44.89,39.82 48.96,39.82 U1.22
  Bottom 0.254: GPIO1.2 34.29,15.75 v35.05,16.51
IO20  (via drill 0.35)
  Top 0.254: v35.05,19.05 R18.1
  Top 0.406: GPIO1.3 36.83,6.11 44.63,13.91 44.63,37.39 45.5,38.26 U1.23
  Bottom 0.254: GPIO1.3 36.83,17.27 v35.05,19.05
IO21
  Top 0.406: GPIO1.4 39.37,7.9 45.16,13.69 45.16,36.02 45.97,36.83 48.95,36.83 U1.24
IO26
  Top 0.406: GPIO1.5 41.91,9.68 45.7,13.47 45.7,34.39 46.61,35.31 48.97,35.31 U1.25
IO33
  Top 0.406: GPIO1.6 44.45,11.47 46.23,13.25 46.23,25.65 49.78,29.21 49.78,31.74 U1.27
IO34  (via drill 0.35)
  Top 0.254: SPI.4 6.1,46.99 v7.24,45.85 | U1.28 51.26,38.9 v51.18,38.98
  Top 0.406: GPIO1.7 46.99,11.3 51.31,15.62 51.31,31.72 U1.28
  Bottom 0.254: v7.24,45.85 7.75,45.34 14.29,45.34 21.28,38.35 24.82,38.35 25.59,39.12 51.05,39.12 v51.18,38.98
IO35_MOSI  (via drill 0.35)
  Top 0.254: U$1.14 U$2.19 16.27,56.51 v15.62,57.15 | SPI.2 4.7,44.07 6.89,44.07 9.29,46.47 v9.81,46.47 | U1.29 52.76,39.3 v52.7,39.36
  Top 0.406: GPIO1.8 49.53,13.09 51.84,15.4 51.84,28.73 52.76,29.65 U1.29
  Bottom 0.254: v15.62,57.15 15.62,57.02 5.84,47.24 5.84,42.67 5.08,41.91 SPI.2 | v9.81,46.47 13.7,46.47 21.44,38.73 24.66,38.73 25.43,39.5 52.57,39.5 v52.7,39.36
IO36_SCK  (via drill 0.35)
  Top 0.254: U$1.13 U$2.18 16.77,56.77 v16.38,57.15 | v54.23,39.37 54.23,31.8 U1.30
  Top 0.406: GPIO1.9 52.07,14.87 52.38,15.18 52.38,28.51 54.26,30.39 U1.30
  Bottom 0.254: v16.38,57.15 6.22,46.99 6.22,46.98 | 6.22,46.98 6.22,40.61 5.37,39.75 2.92,39.75 SPI.1 | 6.22,46.98 13.72,46.98 21.6,39.11 24.5,39.11 25.27,39.88 53.72,39.88 v54.23,39.37
IO37  (via drill 0.35)
  Top 0.254: SPI.3 6.73,44.45 9.78,47.5 v10.16,47.5 | v55.75,38.61 55.75,31.77 U1.31
  Top 0.406: GPIO1.10 54.61,13.59 52.91,15.29 52.91,28.29 55.76,31.14 U1.31
  Bottom 0.254: v10.16,47.5 13.75,47.5 21.76,39.49 24.34,39.49 25.11,40.26 54.1,40.26 v55.75,38.61
IO38_BUSY  (via drill 0.35)
  Top 0.254: U$2.14 U$1.9 18.77,47.69 v19.64,46.82 | v57.29,40.02 57.29,31.79 U1.32
  Top 0.406: GPIO1.11 57.15,4.32 55.14,6.33 55.14,13.81 53.44,15.51 53.44,28.07 55.6,30.23 56.77,30.23 57.29,30.75 57.29,31.79
  Bottom 0.254: v19.64,46.82 19.64,46.69 24.03,42.3 25.55,42.3 26.07,41.78 55.53,41.78 v57.29,40.02
IO39_RST  (via drill 0.35)
  Top 0.254: U$2.15 U$1.10 18.27,47.46 v18.45,47.28 | v58.77,37.81 U1.33
  Top 0.406: GPIO1.12 55.68,6.55 55.68,14.03 53.98,15.73 53.98,27.84 55.82,29.69 56.99,29.69 58.77,31.47 U1.33
  Bottom 0.254: v18.45,47.28 18.45,47.15 23.68,41.92 25.39,41.92 25.91,41.4 55.18,41.4 v58.77,37.81
IO40_DC  (via drill 0.35)
  Top 0.254: U$2.16 U$1.11 17.77,47.26 v17.75,47.24 | v59.99,35.86 59.99,32.03 U1.34 60.26,27.24 61.34,26.16 61.34,3.43 GPIO1.13
  Bottom 0.254: v17.75,47.24 23.45,41.54 25.14,41.54 25.65,41.02 54.83,41.02 v59.99,35.86
IO41_CS  (via drill 0.35)
  Top 0.254: U$2.17 U$1.12 17.27,47.62 16.76,47.12 v16.51,47.12 | v61.72,33.4 61.76,33.36 U1.35 61.76,5.8 62.87,4.7 64.01,4.7 64.77,3.94 GPIO1.14
  Bottom 0.254: v16.51,47.12 17.14,47.12 17.53,46.74 17.65,46.74 23.23,41.16 24.98,41.16 25.5,40.64 54.48,40.64 v61.72,33.4
IO42
  Top 0.254: GPIO1.15 67.31,3.17 65.41,5.08 63.02,5.08 62.14,5.96 62.14,26.2 63.26,27.32 U1.36
IO45  (via drill 0.35)
  Top 0.254: U1.39 67.76,29.39 v67.82,29.34
  Bottom 0.254: GPIO1.16 68.07,4.32 68.07,8.76 67.08,9.75 64.14,9.75 63.32,10.57 63.32,26.98 64.73,28.38 66.86,28.38 v67.82,29.34
IO46  (via drill 0.35)
  Top 0.254: U1.40 69.26,29.35 v68.09,28.18
  Bottom 0.254: v68.09,28.18 67.91,28 64.89,28 63.7,26.82 63.7,10.73 64.3,10.13 70.64,10.13 72.39,8.38 GPIO1.17
MP_INT  (via drill 0.35)
  Top 0.305: IC1.3 13.72,12.7 | 13.72,12.7 13.72,13.37 R24.1 | 20,25.5 R26.1 | 20,24.13 v21.08,24.13 | v12.7,12.7 13.72,12.7
  Top 0.406: R21.2 R24.1 | IC2.1 20,24.13 20,25.5
  Bottom 0.305: v21.08,24.13 21.08,22.74 16.09,17.75 16.09,16.41 18.58,13.93 18.58,7.27 17.11,5.81 14.26,5.81 12.7,7.37 12.7,11.43 v12.7,12.7
N$1
  Top 0.254: U$2.29 U$1.24 11.27,46.43 C1.1
N$2
  Top 0.254: U$2.28 U$1.23 11.77,43.12 C2.1 10.54,41.9 10.54,39.11 D2.A
N$3
  Top 0.254: U$2.27 U$1.22 12.27,46.79 12.7,46.35 C3.1
N$4
  Top 0.254: U$2.26 U$1.21 12.77,46.92 13.97,45.72 C4.1 13.08,41.9 13.08,39.11 D1.C
N$5
  Top 0.254: U$2.25 U$1.20 13.27,46.96 14.9,45.33 C5.1
N$6
  Top 0.254: U$2.24 U$1.19 13.77,47 14.66,46.1 15.88,46.1 16.51,45.48 C6.1
N$7
  Top 0.254: U$2.23 U$1.18 14.27,47.08 14.86,46.48 16.04,46.48 17.2,45.33 C11.1
N$8
  Top 0.406: R7.1 9.65,31.75 11.81,29.59 20.7,29.59 21.59,30.48 21.59,34.92 21.4,35.12 | L1.1 20.95,35.56 21.4,35.12 | C12.1 21.4,35.12
N$9
  Top 0.305: R28.1 18.1,25.5
  Top 0.406: 18.1,25.5 IC2.3
N$10  (via drill 0.35)
  Top 0.254: U$2.8 U$1.3 21.77,44.4 22.61,43.56 22.61,38.61 v21.21,37.21 | v19.81,30.86 18.71,30.86 R2.1
  Top 0.406: R2.1 18.59,30.82 Q1.2
  Bottom 0.254: v21.21,37.21 19.81,35.81 v19.81,30.86
N$11
  Top 0.254: U$2.10 U$1.5 20.77,46.93 20.32,46.48 C9.1
N$12
  Top 0.254: U$2.9 U$1.4 21.27,44.27 21.59,43.94 C7.1
N$13  (via drill 0.35)
  Top 0.254: U$2.7 U$1.2 22.27,44.44 22.99,43.72 22.99,38.18 v22.63,37.82 | v14.48,32.77 14.48,30.82
  Top 0.406: Q1.1 14.48,30.82 13.29,30.82 R1.1
  Bottom 0.254: v22.63,37.82 22.6,37.85 19.44,37.85 14.48,32.89 v14.48,32.77
N$14
  Top 0.305: IC1.2 14.22,13.75 R20.2 R19.1
N$16
  Top 0.406: C10.1 5.24,34.93 D3.A D2.C
N$17
  Top 0.406: IC2.5 22.44,20.32 R25.2
N$18
  Top 0.305: IC1.4 10.49,11.11 C22.1 10.41,12.45 9.14,13.72 9.14,15.62 9.65,16.13 10.5,16.13 R21.1
N$19
  Top 0.406: 12.7,36.44 11.18,36.44 9.91,37.7 6.78,37.7 6.76,37.72 C10.2 | 12.7,36.44 14.9,36.44 L1.2 15.88,35.47 Q1.3 | D1.A 12.7,36.44
N$21  (via drill 0.35)
  Top 0.305: v30.99,13.46 30.99,13.59 31.37,13.97 R13.2
  Bottom 0.305: J2.P$12 27.2,13.46 v30.99,13.46
N$22  (via drill 0.35)
  Top 0.305: R14.2 31.15,10.41 v30.86,10.41
  Bottom 0.305: J2.P$5 23.8,14.02 23.17,13.39 21.48,13.39 20.83,12.74 20.83,11.05 21.46,10.41 v30.86,10.41
N$23
  Top 0.305: R15.2 27.81,8.89 26.52,7.59 J1.B5
N$24  (via drill 0.35)
  Top 0.305: R16.2 30.48,4.66 v30.48,4.57 | J1.A5 23.52,5.51 v23.5,5.5
  Bottom 0.305: v30.48,4.57 30.33,4.42 24.57,4.42 v23.5,5.5
N$28
  Top 0.254: T2.1 66.61,15.41 67.59,16.38 68.87,16.38 R10.2
N$52
  Top 0.254: R9.2 68.87,13.84 65.79,13.84 64.9,14.73 64.9,18.9 66.36,20.36 T1.1
P8  (via drill 0.35)
  Top 0.254: U$2.13 U$1.8 19.3,48.22 19.3,47.69 19.62,47.37 v20.07,47.37 | R3.2 v27.3,44.45 R4.2
  Bottom 0.254: v20.07,47.37 22.99,44.45 v27.3,44.45
P15  (via drill 0.35)
  Top 0.254: U$2.20 U$1.15 15.77,47.13 v15.75,47.12 | v18.8,43.81 18.8,43.04 C8.1 | R5.1 v24.77,40.64
  Bottom 0.254: v15.75,47.12 15.75,46.74 18.67,43.81 v18.8,43.81 18.8,43.69 21.84,40.64 v24.77,40.64
P16  (via drill 0.35)
  Top 0.254: U$2.21 U$1.16 15.27,47.52 v14.99,47.24 | v24,40.01 25.82,38.19 R6.1
  Bottom 0.254: v14.99,47.24 14.86,47.12 14.73,47.12 21.84,40.01 v24,40.01
RTS
  Top 0.254: T1.2 68.26,20.24 69.45,19.05 70.74,19.05 71.97,17.82 R10.1 72.77,17.78 75.31,15.24 PROG.6
RXD0  (via drill 0.35)
  Top 0.254: U1.38 66.26,26.7 v66.29,26.67
  Bottom 0.254: v66.29,26.67 65.15,25.53 65.15,15.4 66.83,13.72 71.85,13.72 73.27,15.13 73.27,18.5 75.09,20.32 PROG.4
TXD0  (via drill 0.35)
  Top 0.254: v75.06,16.38 76.45,17.78 PROG.5 | U1.37 v64.76,26.42 v64.77,26.42
  Bottom 0.254: v75.06,16.38 72.01,13.34 66.67,13.34 64.77,15.24 v64.77,26.42

### Text on the board
tNames: IO17 / IO16 / IO15 / IO14 / IO13 / IO12 / IO11 / IO10 / IO9 / IO8 / IO7 / IO6 / IO5 / IO4 / IO3 / IO2 / IO1 / IO0 | SCK=36, MOSI=35, / MISO=37, CS=34 | GND / 3V3 / CS / MISO / MOSI / SCK | twitch.tv/bastlir / ESP32-S2 ePaper / DevBoard v1 / 2020-11-18 | GND / DTR / 3V3 / TX / RX / RTS | GND / 3V3 / SDA / SCL | 8 / 9 | IO18 / IO19 / IO20 / IO21 / IO26 / IO33 / IO34 / IO35 / IO36 | IO37 / IO38 / IO39 / IO40 / IO41 / IO42 / IO45 / IO46 | - | + | -+ | -+
bNames: 3V3 Regulators: | ePaper GPIO: / / MOSI IO35 / SCK IO36 / CS IO41 / DC IO40 / RST IO39 / BUSY IO38 | XC6210: / C15, C16, U3 | HT7833: / C13, C14, U2 | MCP73831: / C26, C27, / R26, R27 / R25 - prog. current / 2k0 ohm = 500mA / 4k7 ohm = 212mA | MP2667: / C22, C23, C24, C25, / R19, R20, R21 | Use R29 ONLY when / no battery charge IC / is present. It will / connect +5V / to regulators. | Charge battery IC: | R24: Connect INT to IO7